# Altium schematic sheet 2020智能车.SchDoc
size A1; Organization: Altium Limited; Address1: L3, 12a Rodborough Rd; Address2: Frenchs Forest; Address3: NSW; Address4: Australia 2086
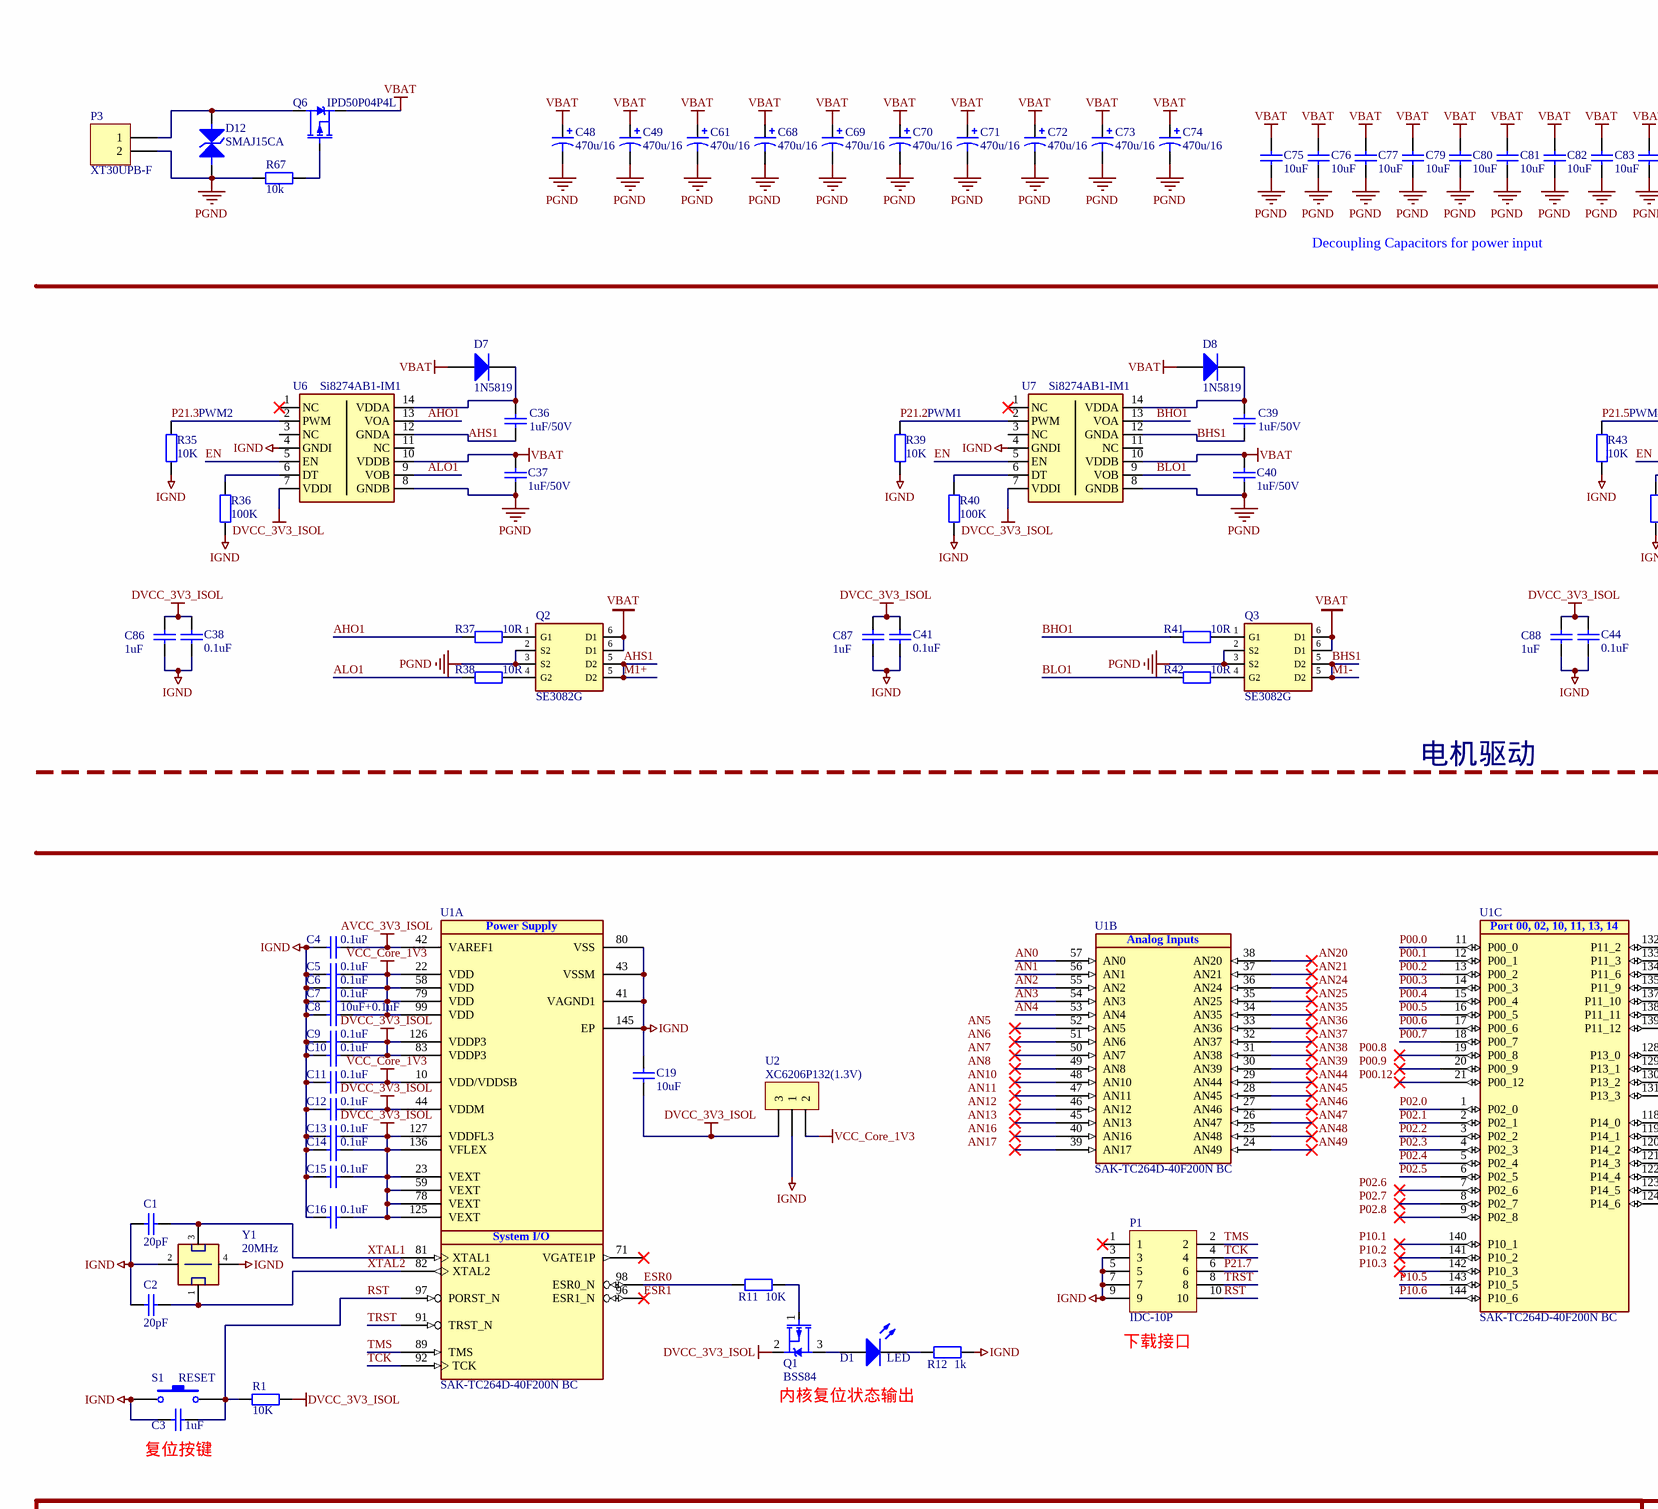
[diagram p0: 2020智能车.SchDoc, top left]
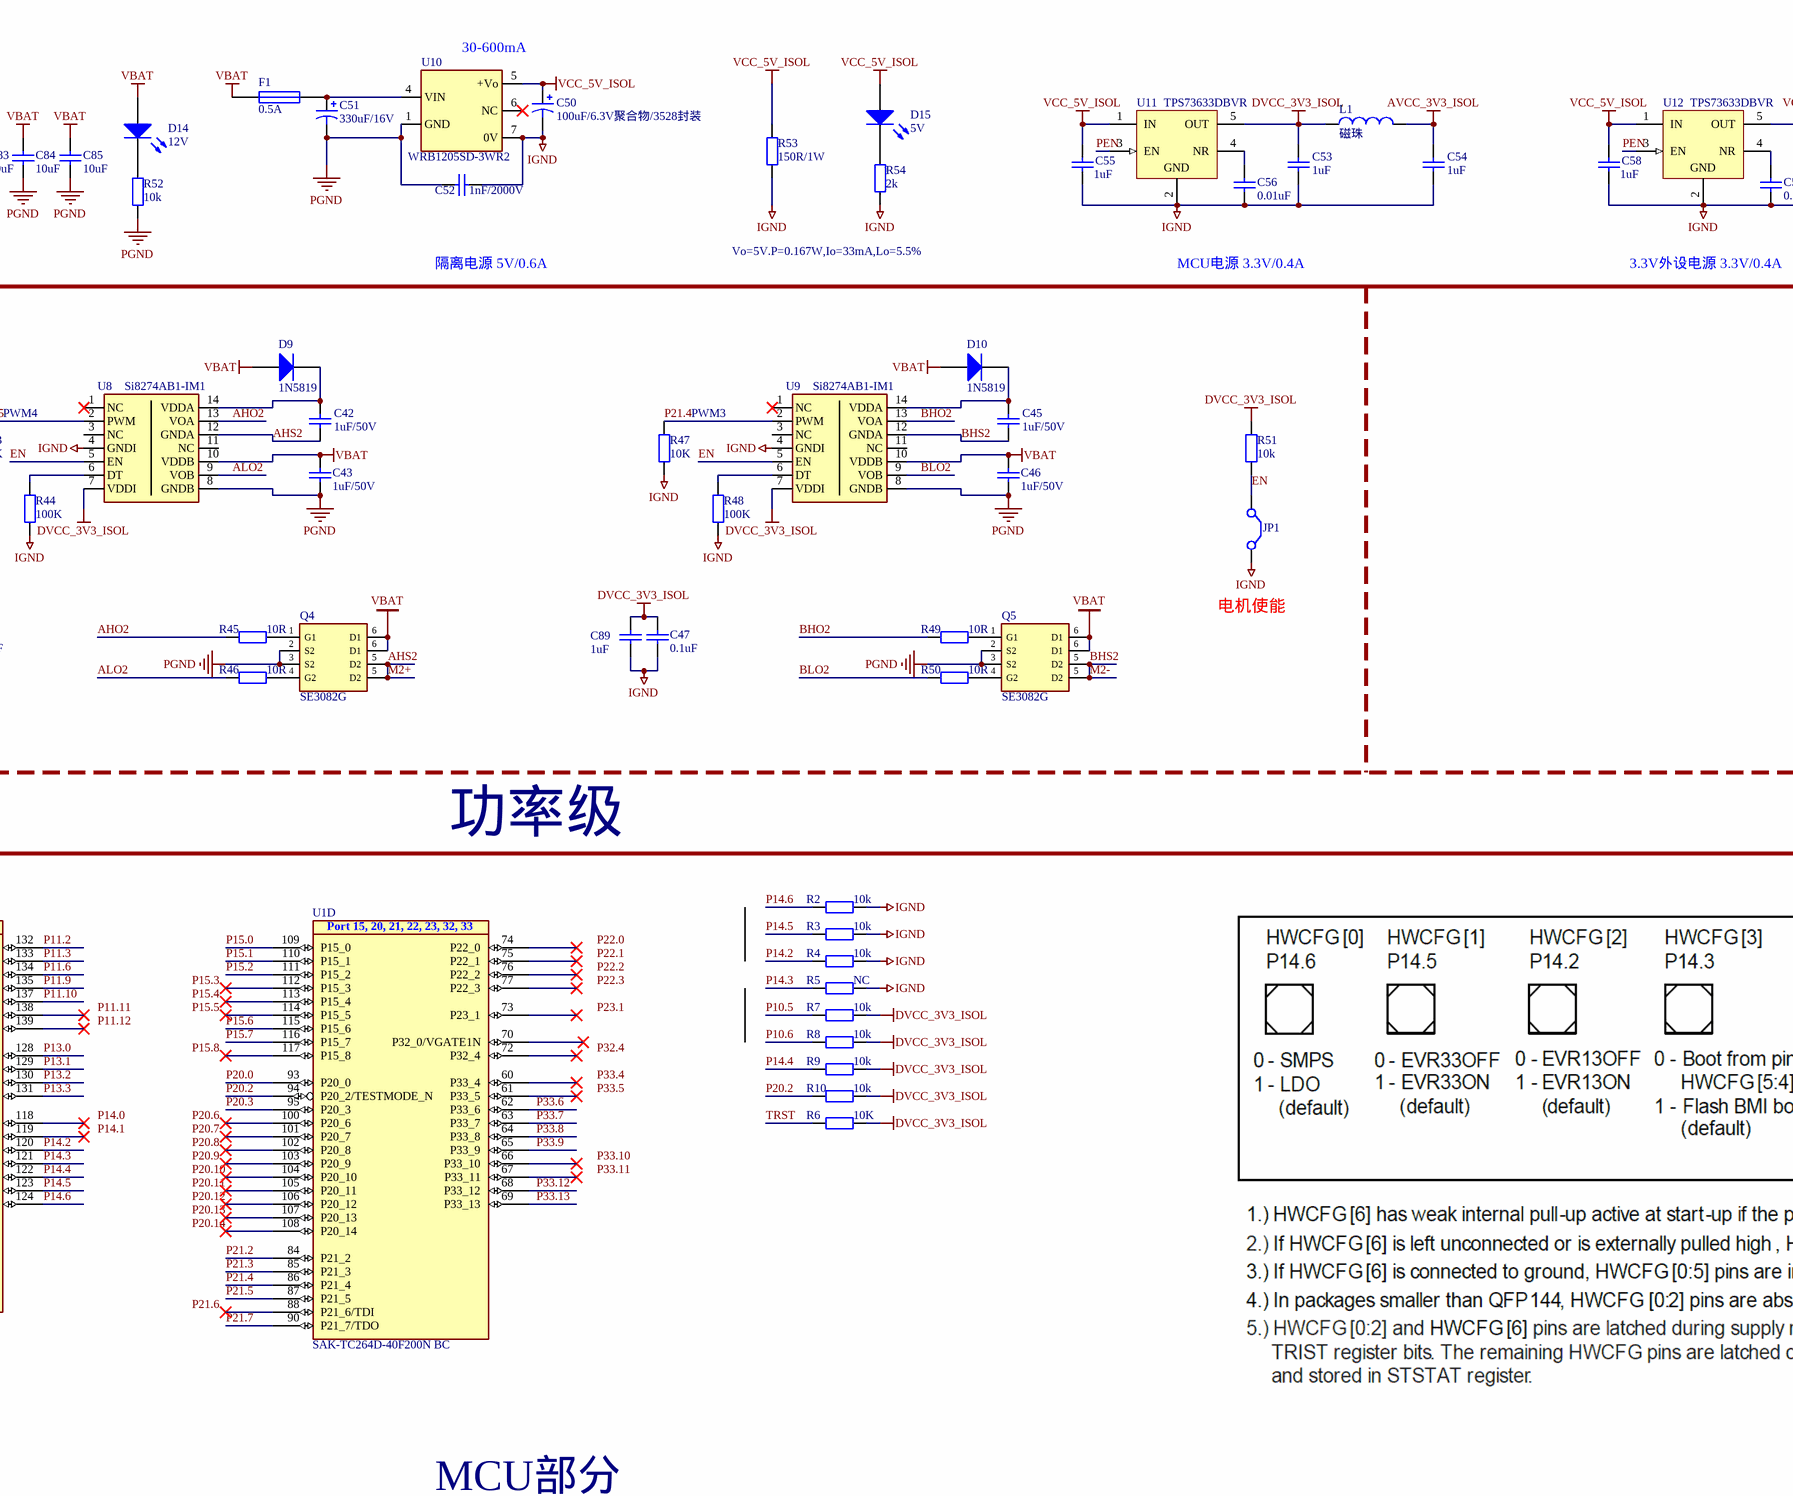
[diagram p1: 2020智能车.SchDoc, top middle]
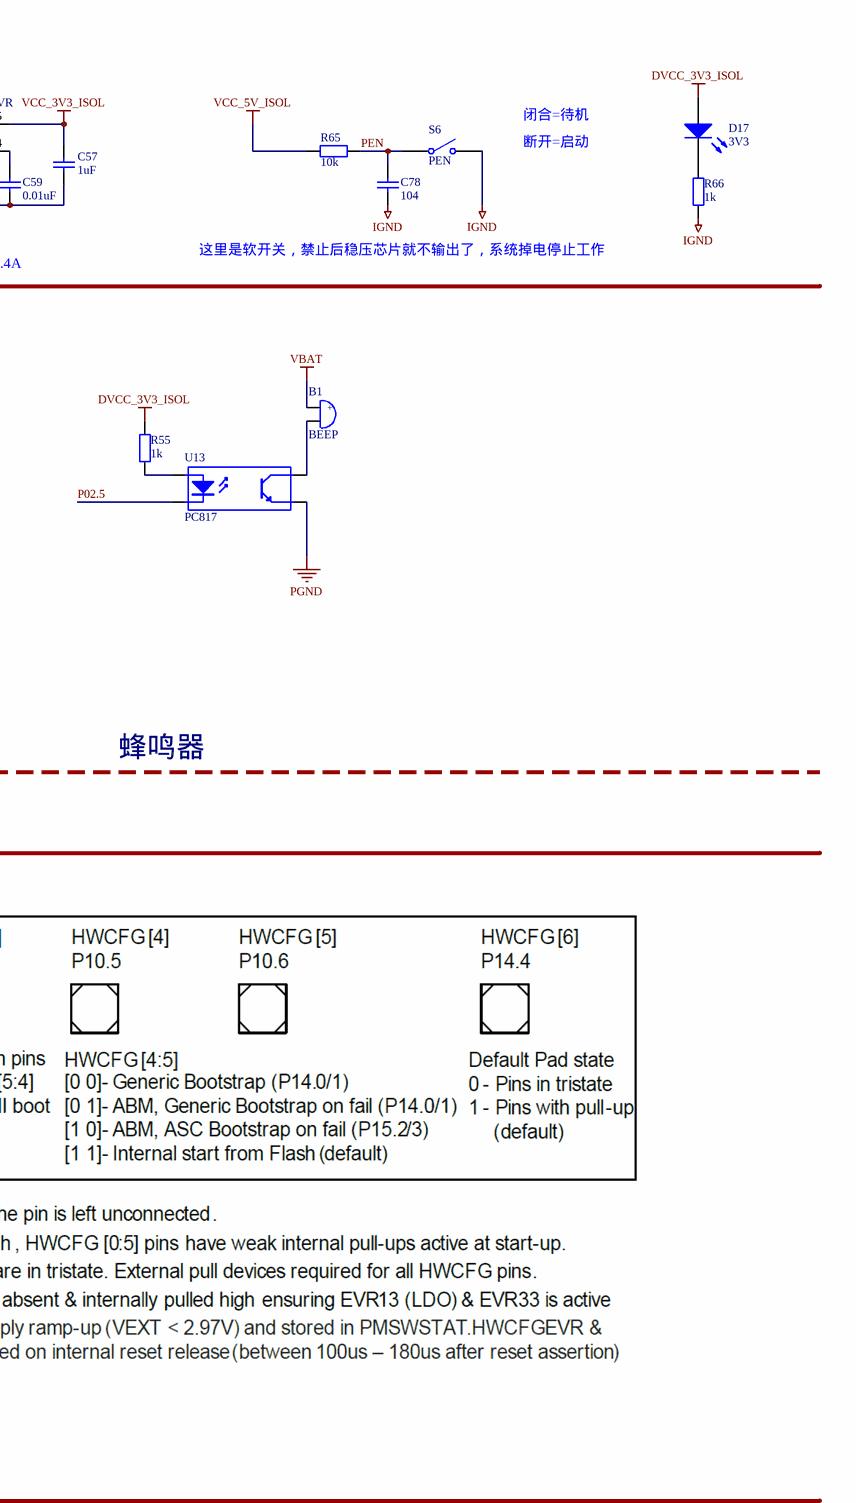
[diagram p2: 2020智能车.SchDoc, top right]
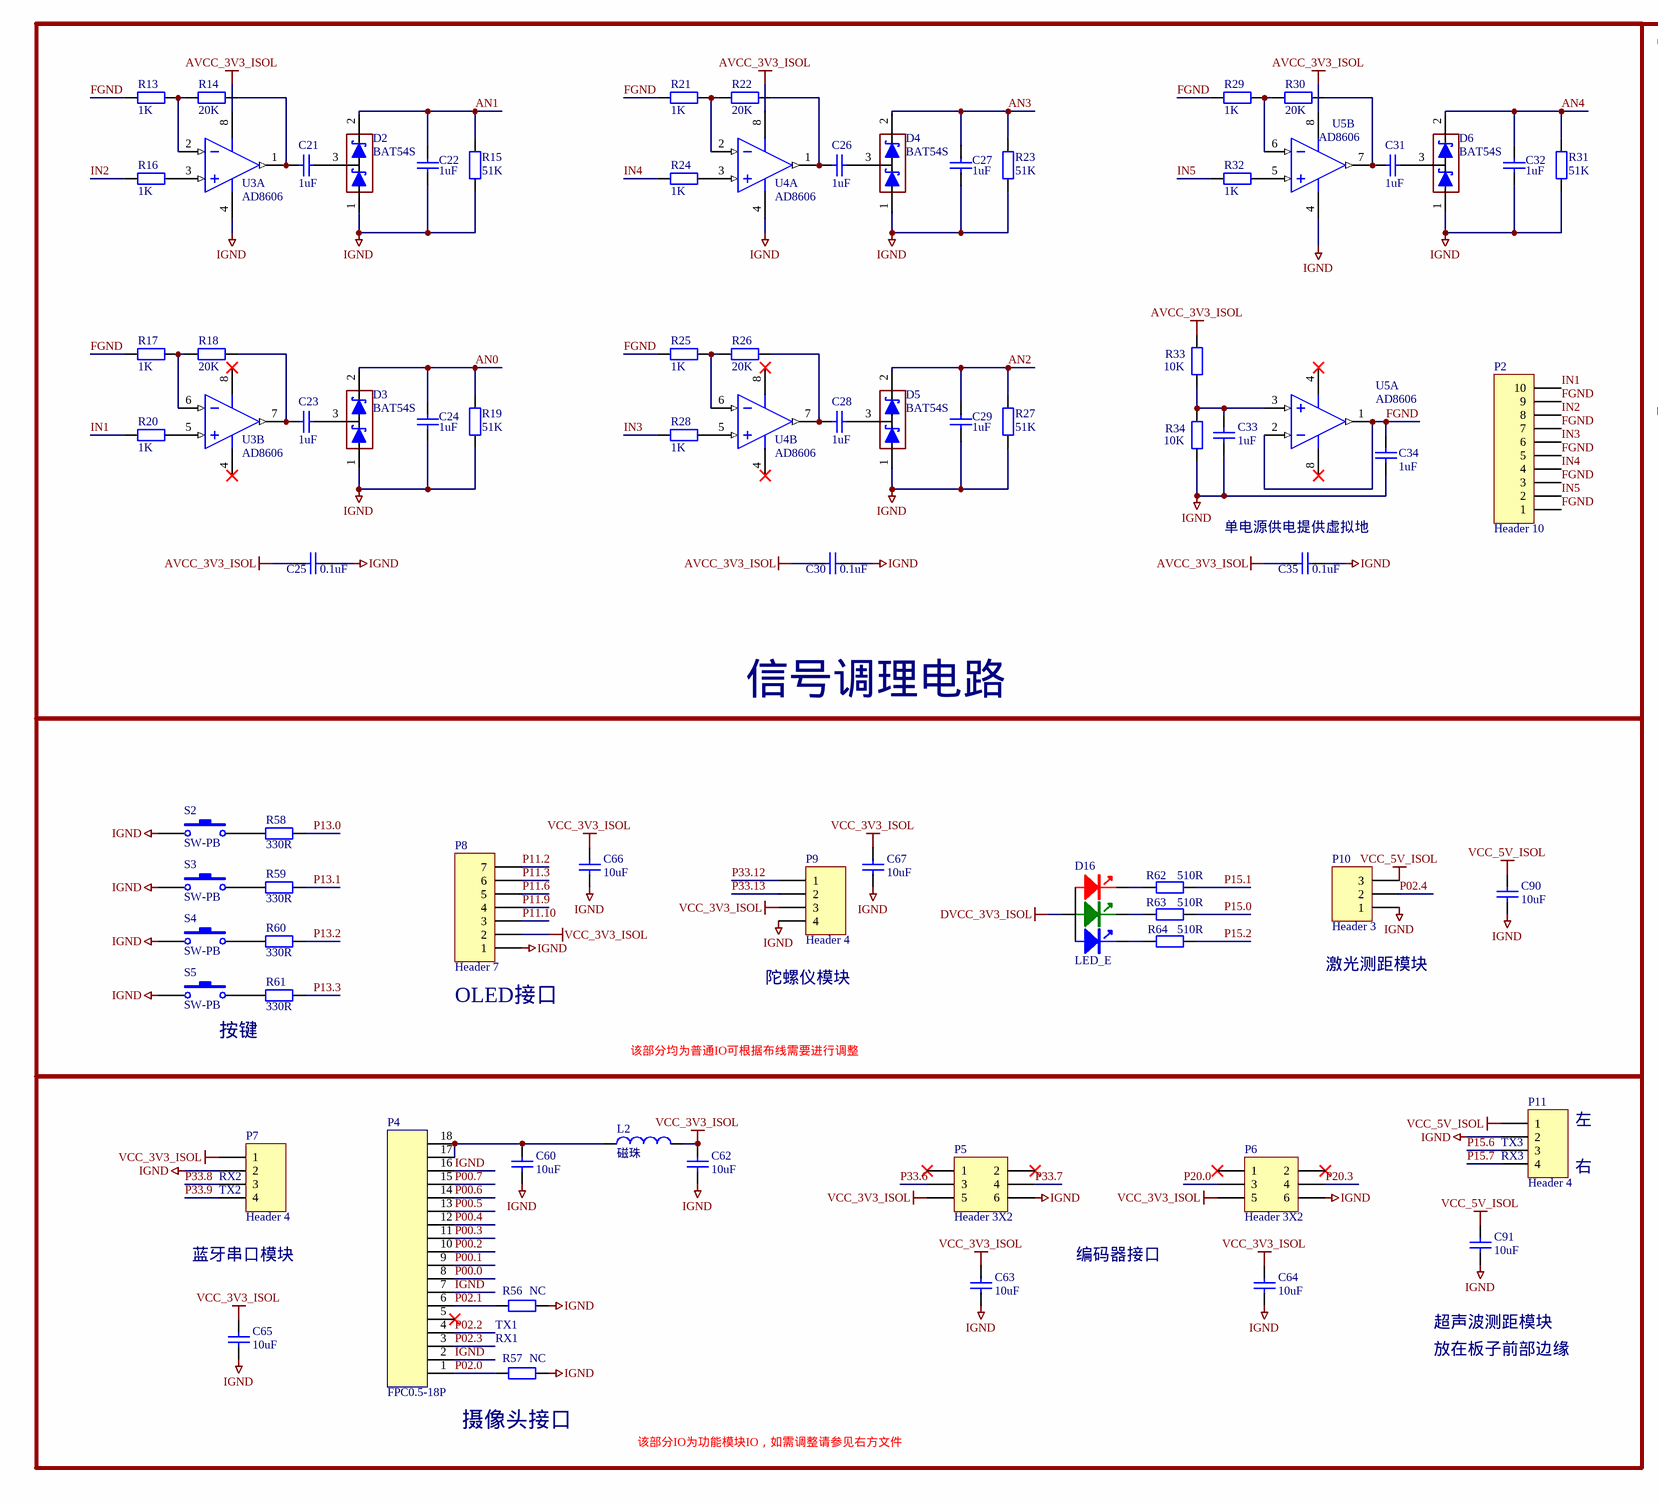
[diagram p3: 2020智能车.SchDoc, bottom left]
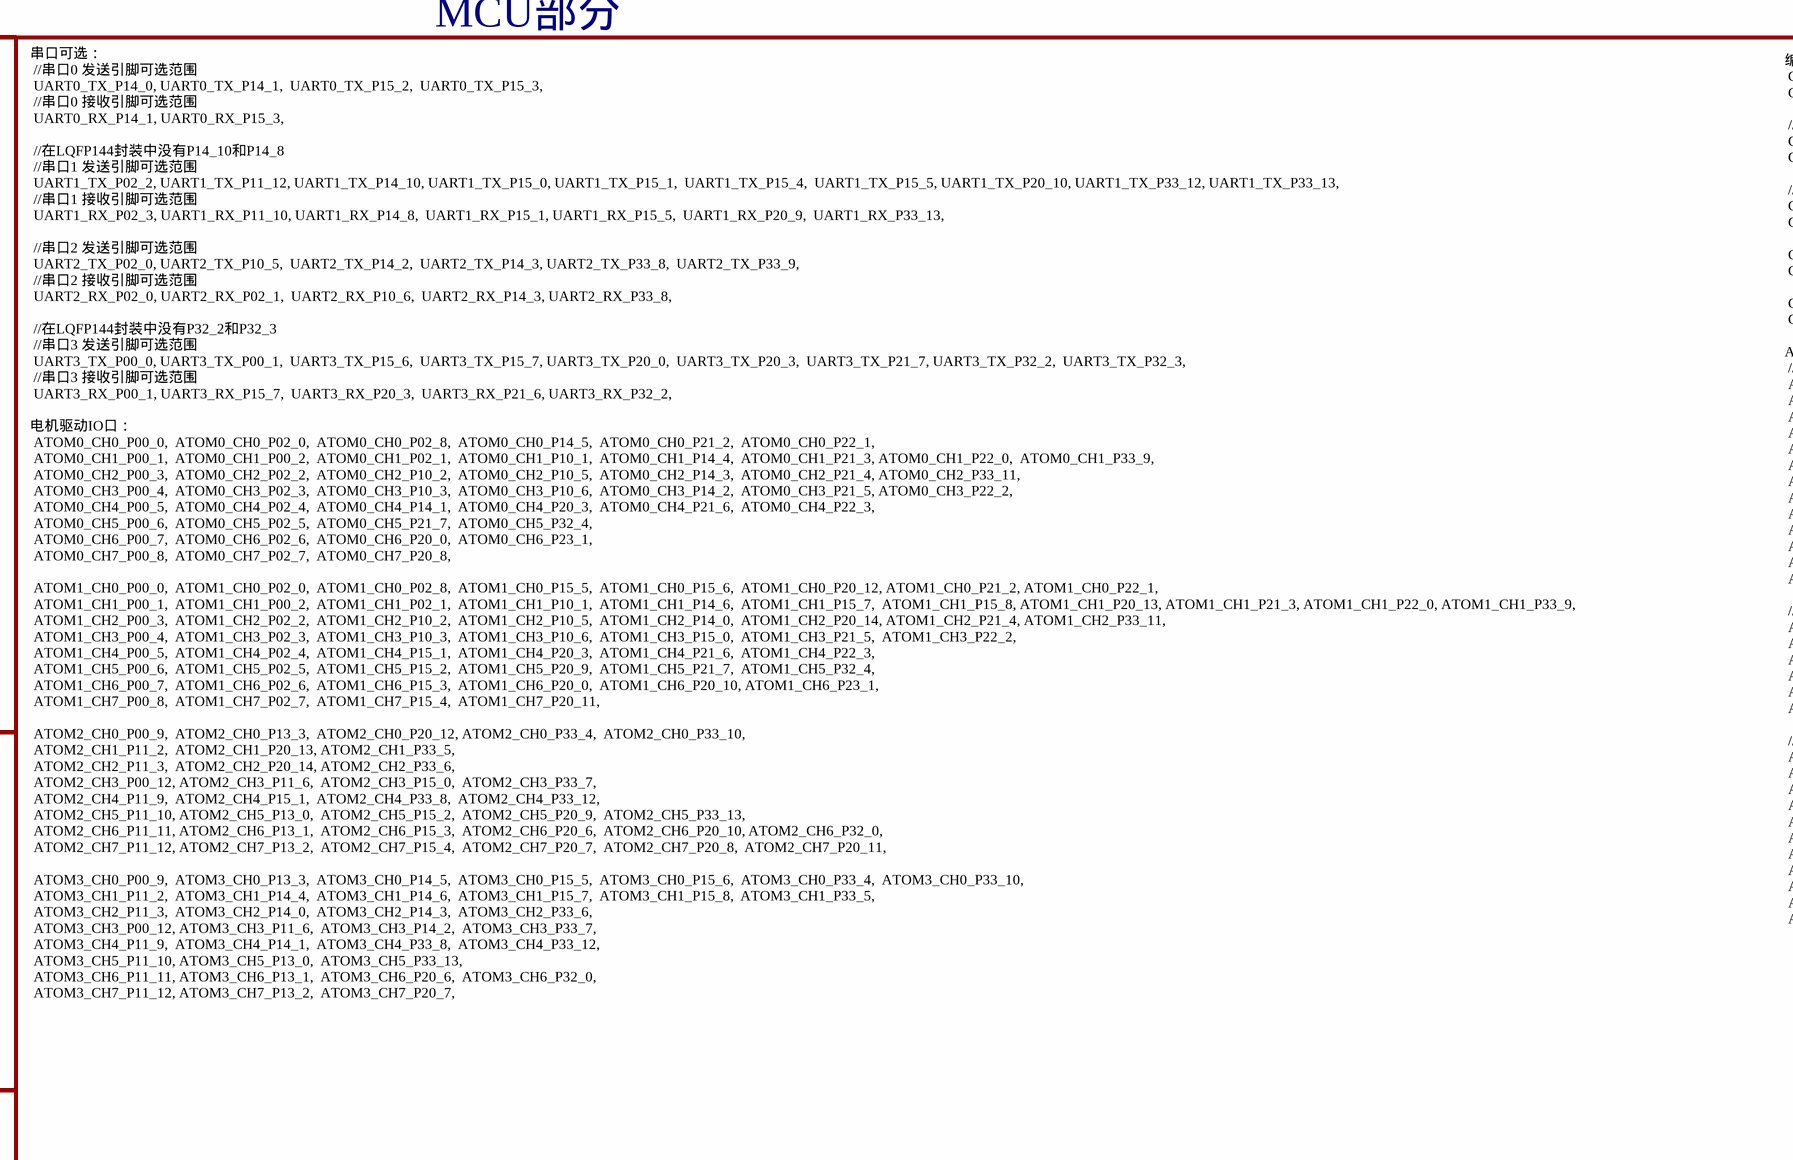
[diagram p4: 2020智能车.SchDoc, bottom middle]
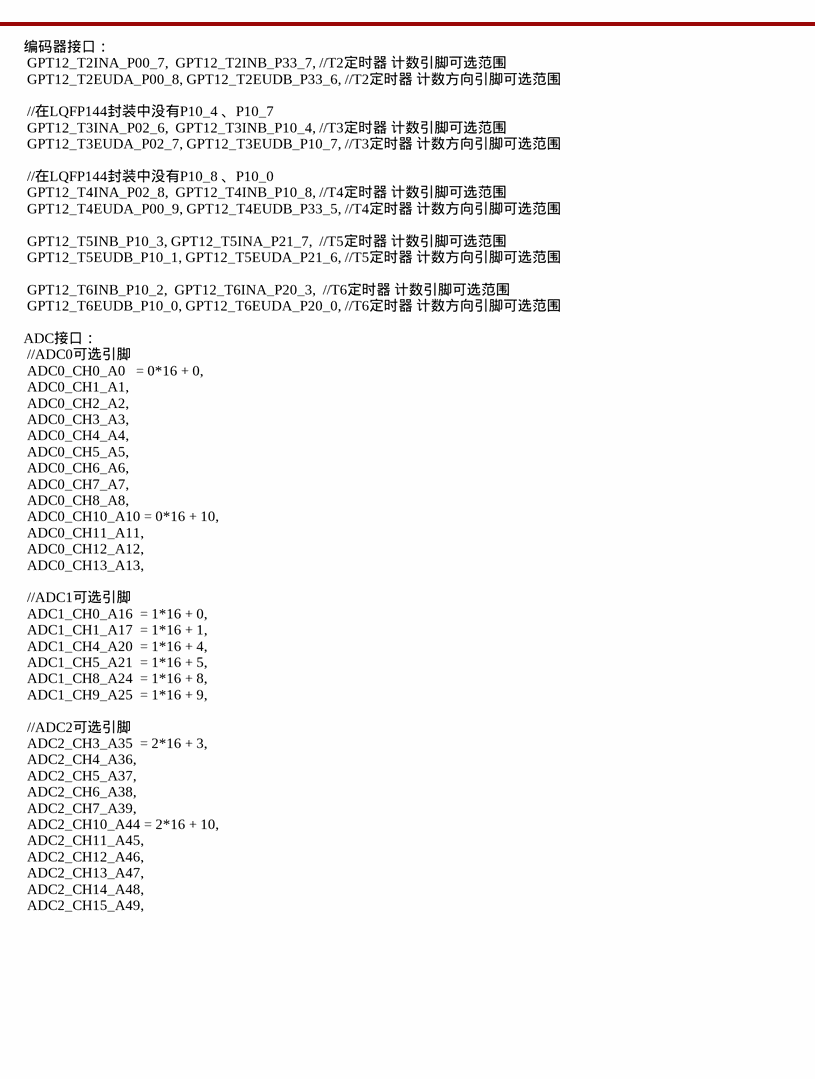
[diagram p5: 2020智能车.SchDoc, bottom right]

## Parts
B1  BEEP  [E10/5]
C1  value 20pF  [0603-1]  (hidden comment: Cap)
C2  value 20pF  [0603-1]  (hidden comment: Cap)
C3  1uF  [0603-1]
C4  0.1uF  [0603-1]
C5  0.1uF  [0603-1]
C6  0.1uF  [0603-1]
C7  0.1uF  [0603-1]
C8  10uF+0.1uF  [0603-1]
C9  0.1uF  [0603-1]
C10  0.1uF  [0603-1]
C11  0.1uF  [0603-1]
C12  0.1uF  [0603-1]
C13  0.1uF  [0603-1]
C14  0.1uF  [0603-1]
C15  0.1uF  [0603-1]
C16  0.1uF  [0603-1]
C19  10uF  [0603-1]
C21  1uF  [0603-1]
C22  1uF  [0603-1]
C23  1uF  [0603-1]
C24  1uF  [0603-1]
C25  0.1uF  [0603-1]
C26  1uF  [0603-1]
C27  1uF  [0603-1]
C28  1uF  [0603-1]
C29  1uF  [0603-1]
C30  0.1uF  [0603-1]
C31  1uF  [0603-1]
C32  1uF  [0603-1]
C33  1uF  [0603-1]
C34  1uF  [0603-1]
C35  0.1uF  [0603-1]
C36  1uF/50V  [0603-1]
C37  1uF/50V  [0603-1]
C38  0.1uF  [0603-1]
C39  1uF/50V  [0603-1]
C40  1uF/50V  [0603-1]
C41  0.1uF  [0603-1]
C42  1uF/50V  [0603-1]
C43  1uF/50V  [0603-1]
C44  0.1uF  [0603-1]
C45  1uF/50V  [0603-1]
C46  1uF/50V  [0603-1]
C47  0.1uF  [0603-1]
C48  470u/16  [E10/5]
C49  470u/16  [E10/5]
C50  100uF/6.3V聚合物/3528封装  [3528-B]
C51  330uF/16V  [E6.5/2.5]
C52  1nF/2000V  [1812]
C53  1uF  [0603-1]
C54  1uF  [0603-1]
C55  1uF  [0603-1]
C56  0.01uF  [0603-1]
C57  1uF  [0603-1]
C58  1uF  [0603-1]
C59  0.01uF  [0603-1]
C60  10uF  [0603-1]
C61  470u/16  [E10/5]
C62  10uF  [0603-1]
C63  10uF  [0805-3]
C64  10uF  [0805-3]
C65  10uF  [0603-1]
C66  10uF  [0603-1]
C67  10uF  [0603-1]
C68  470u/16  [E10/5]
C69  470u/16  [E10/5]
C70  470u/16  [E10/5]
C71  470u/16  [E10/5]
C72  470u/16  [E10/5]
C73  470u/16  [E10/5]
C74  470u/16  [E10/5]
C75  10uF  [3528-B]
C76  10uF  [3528-B]
C77  10uF  [3528-B]
C78  104  [0603-1]
C79  10uF  [3528-B]
C80  10uF  [3528-B]
C81  10uF  [3528-B]
C82  10uF  [3528-B]
C83  10uF  [3528-B]
C84  10uF  [3528-B]
C85  10uF  [3528-B]
C86  1uF  [0603-1]
C87  1uF  [0603-1]
C88  1uF  [0603-1]
C89  1uF  [0603-1]
C90  10uF  [0603-1]
C91  10uF  [0603-1]
D1  LED  [0603-3]
D2  BAT54S  [SOT-23-3]
D3  BAT54S  [SOT-23-3]
D4  BAT54S  [SOT-23-3]
D5  BAT54S  [SOT-23-3]
D6  BAT54S  [SOT-23-3]
D7  1N5819  [3216-A]
D8  1N5819  [3216-A]
D9  1N5819  [3216-A]
D10  1N5819  [3216-A]
D12  SMAJ15CA  [6032-C]
D14  12V  [0603-3]
D15  5V  [0603-3]
D16  LED_E  [1210-DLED]
D17  3V3  [0603-3]
F1  0.5A  [1812]
JP1  Jumper  [CON-2S]  (value not drawn)
L1  磁珠  [0805-3]
L2  磁珠  [0805-3]
P1  IDC-10P  [MHDR2X5]
P2  Header 10  [MX 1.25-WS-10P]
P3  XT30UPB-F  [XT30UPB-F]
P4  FPC0.5-18P  [FPC18-0.5]
P5  Header 3X2  [con-6D]
P6  Header 3X2  [con-6D]
P7  Header 4  [con-4s]
P8  Header 7  [con-7s]
P9  Header 4  [con-4S]
P10  Header 3  [CON-3S]
P11  Header 4  [CON-4S]
Q1  BSS84  [SOT-23-3]
Q2  SE3082G  [DFN-8_L5.5-W5.2-P1.27-LS6.0-BL-EP2]
Q3  SE3082G  [DFN-8_L5.5-W5.2-P1.27-LS6.0-BL-EP2]
Q4  SE3082G  [DFN-8_L5.5-W5.2-P1.27-LS6.0-BL-EP2]
Q5  SE3082G  [DFN-8_L5.5-W5.2-P1.27-LS6.0-BL-EP2]
Q6  IPD50P04P4L  [TO-252]
R1  10K  [0603-1]
R2  10k  [0603-1]
R3  10k  [0603-1]
R4  10k  [0603-1]
R5  NC  [0603-1]
R6  10K  [0603-1]
R7  10k  [0603-1]
R8  10k  [0603-1]
R9  10k  [0603-1]
R10  10k  [0603-1]
R11  10K  [0603-1]
R12  1k  [0603-1]
R13  1K  [0603-1]
R14  20K  [0603-1]
R15  51K  [0603-1]
R16  1K  [0603-1]
R17  1K  [0603-1]
R18  20K  [0603-1]
R19  51K  [0603-1]
R20  1K  [0603-1]
R21  1K  [0603-1]
R22  20K  [0603-1]
R23  51K  [0603-1]
R24  1K  [0603-1]
R25  1K  [0603-1]
R26  20K  [0603-1]
R27  51K  [0603-1]
R28  1K  [0603-1]
R29  1K  [0603-1]
R30  20K  [0603-1]
R31  51K  [0603-1]
R32  1K  [0603-1]
R33  10K  [0603-1]
R34  10K  [0603-1]
R35  10K  [0603-1]
R36  100K  [0603-1]
R37  10R  [0603-1]
R38  10R  [0603-1]
R39  10K  [0603-1]
R40  100K  [0603-1]
R41  10R  [0603-1]
R42  10R  [0603-1]
R43  10K  [0603-1]
R44  100K  [0603-1]
R45  10R  [0603-1]
R46  10R  [0603-1]
R47  10K  [0603-1]
R48  100K  [0603-1]
R49  10R  [0603-1]
R50  10R  [0603-1]
R51  10k  [0603-1]
R52  10k  [0603-1]
R53  150R/1W  [1812]
R54  2k  [0603-1]
R55  1k  [0603-1]
R56  NC  [0603-1]
R57  NC  [0603-1]
R58  330R  [0603-1]
R59  330R  [0603-1]
R60  330R  [0603-1]
R61  330R  [0603-1]
R62  510R  [0603-1]
R63  510R  [0603-1]
R64  510R  [0603-1]
R65  10k  [0603-1]
R66  1k  [0603-1]
R67  10k  [0603-1]
S1  RESET  [TD-3580]
S2  SW-PB  [TD-3580]
S3  SW-PB  [TD-3580]
S4  SW-PB  [TD-3580]
S5  SW-PB  [TD-3580]
S6  PEN  [SSD1210]
U1  SAK-TC264D-40F200N BC  [QFP50P2200X2200X160-145N-1]  (parts A,B,C,D of 4)
U2  XC6206P132(1.3V)  [SOT-23-3]
U3  AD8606  [SO-8]  (parts A,B of 2)
U4  AD8606  [SO-8]  (parts A,B of 2)
U5  AD8606  [SO-8]  (parts A,B of 2)
U6  Si8274AB1-IM1  [LGA-14_L5.0-W5.0-P0.65-BL]
U7  Si8274AB1-IM1  [LGA-14_L5.0-W5.0-P0.65-BL]
U8  Si8274AB1-IM1  [LGA-14_L5.0-W5.0-P0.65-BL]
U9  Si8274AB1-IM1  [LGA-14_L5.0-W5.0-P0.65-BL]
U10  WRB1205SD-3WR2  [WRB_SD-3WR2]
U11  TPS73633DBVR  [SOT-23-5]
U12  TPS73633DBVR  [SOT-23-5]
U13  PC817  [DIP-4]
Y1  20MHz  [CFPX-5]

## Blocks framed on the sheet
单电源供电提供虚拟地: C21-C35 D2-D6 P2 R13-R34 U3-U5
信号调理电路: C66 C67 C90 D16 P8-P10 R58-R64 S2-S5
摄像头接口: C60 C62-C65 C91 L2 P4-P7 P11 R56 R57

## Nets
AVCC_3V3_ISOL: C4.1 C25.1 C30.1 C35.1 C54.1 L1.2 R33.1 U1.42(VAREF1) U3.8(+V) U4.8(+V) U5.8(+V)
DVCC_3V3_ISOL: C9.1 C10.1 C12.1 C13.1 C14.1 C15.1 C16.1 C19.2 C38.2 C41.2 C44.2 C47.2 C53.1 C86.2 C87.2 C88.2 C89.2 D16.2 D17.1(A) L1.1 Q1.2(S) R1.1 R6.1 R7.1 R8.1 R9.1 R10.1 R51.2 R55.1 U1.23(VEXT) U1.44(VDDM) U1.59(VEXT) U1.78(VEXT) U1.83(VDDP3) U1.125(VEXT) U1.126(VDDP3) U1.127(VDDFL3) U1.136(VFLEX) U2.3 U6.7(VDDI) U7.7(VDDI) U8.7(VDDI) U9.7(VDDI) U11.5(OUT)
IGND: C1.1 C2.1 C3.1 C4.2 C5.2 C6.2 C7.2 C8.2 C9.2 C10.2 C11.2 C12.2 C13.2 C14.2 C15.2 C16.2 C19.1 C22.1 C24.1 C25.2 C27.1 C29.1 C30.2 C32.1 C33.2 C34.1 C35.2 C38.1 C41.1 C44.1 C47.1 C50.2 C52.1 C53.2 C54.2 C55.2 C56.1 C57.2 C58.2 C59.1 C60.2 C62.2 C63.2 C64.2 C65.2 C66.2 C67.2 C78.2 C86.1 C87.1 C88.1 C89.1 C90.2 C91.2 D2.1 D3.1 D4.1 D5.1 D6.1 JP1.2(C2) P1.3 P1.5 P1.7 P1.9 P4.2 P4.7 P4.16 P5.6 P6.6 P7.2 P8.1 P9.4 P10.1 P11.2 R2.1 R3.1 R4.1 R5.1 R12.1 R15.2 R19.2 R23.2 R27.2 R31.2 R34.2 R35.1 R36.1 R39.1 R40.1 R43.1 R44.1 R47.1 R48.1 R53.1 R54.1 R56.1 R57.1 R66.1 S1.1 S2.1 S3.1 S4.1 S5.1 S6.2(NO) U1.41(VAGND1) U1.43(VSSM) U1.80(VSS) U1.145(EP) U2.1 U3.4(-V) U4.4(-V) U5.4(-V) U6.4(GNDI) U7.4(GNDI) U8.4(GNDI) U9.4(GNDI) U10.7(0V) U11.2(GND) U12.2(GND) Y1.2 Y1.4
PGND: C37.2 C40.2 C43.2 C46.2 C48.2 C49.2 C51.2 C52.2 C61.2 C68.2 C69.2 C70.2 C71.2 C72.2 C73.2 C74.2 C75.2 C76.2 C77.2 C79.2 C80.2 C81.2 C82.2 C83.2 C84.2 C85.2 D12.K P3.2 Q2.2(S2) Q2.3(S2) Q3.2(S2) Q3.3(S2) Q4.2(S2) Q4.3(S2) Q5.2(S2) Q5.3(S2) R52.1 R67.2 U6.8(GNDB) U7.8(GNDB) U8.8(GNDB) U9.8(GNDB) U10.1(GND) U13.3(E)
VBAT: B1.1 C37.1 C40.1 C43.1 C46.1 C48.1 C49.1 C61.1 C68.1 C69.1 C70.1 C71.1 C72.1 C73.1 C74.1 C75.1 C76.1 C77.1 C79.1 C80.1 C81.1 C82.1 C83.1 C84.1 C85.1 D7.1(A) D8.1(A) D9.1(A) D10.1(A) D14.1(A) F1.1 Q2.6(D1) Q3.6(D1) Q4.6(D1) Q5.6(D1) Q6.S U6.10(VDDB) U7.10(VDDB) U8.10(VDDB) U9.10(VDDB)
VCC_3V3_ISOL: C57.1 C62.1 C63.1 C64.1 C65.1 C66.1 C67.1 L2.2 P5.5 P6.5 P7.1 P8.2 P9.3 U12.5(OUT)
VCC_5V_ISOL: C50.1 C55.1 C58.1 C90.1 C91.1 D15.1(A) P10.3 P11.1 R53.2 R65.1 U10.5(+Vo) U11.1(IN) U12.1(IN)
VCC_Core_1V3: C5.1 C6.1 C7.1 C8.1 C11.1 U1.10(VDD/VDDSB) U1.22(VDD) U1.58(VDD) U1.79(VDD) U1.99(VDD) U2.2
AHO1: R37.1 U6.13(VOA)
AHO2: R45.1 U8.13(VOA)
AHS1: C36.2 Q2.5(D2) U6.12(GNDA)  [also labelled M1+]
AHS2: C42.2 Q4.5(D2) U8.12(GNDA)  [also labelled M2+]
ALO1: R38.1 U6.9(VOB)
ALO2: R46.1 U8.9(VOB)
AN0: C24.2 D3.2 R19.1 U1.57(AN0)
AN1: C22.2 D2.2 R15.1 U1.56(AN1)
AN2: C29.2 D5.2 R27.1 U1.55(AN2)
AN3: C27.2 D4.2 R23.1 U1.54(AN3)
AN4: C32.2 D6.2 R31.1 U1.53(AN4)
BHO1: R41.1 U7.13(VOA)
BHO2: R49.1 U9.13(VOA)
BHS1: C39.2 Q3.5(D2) U7.12(GNDA)  [also labelled M1-]
BHS2: C45.2 Q5.5(D2) U9.12(GNDA)  [also labelled M2-]
BLO1: R42.1 U7.9(VOB)
BLO2: R50.1 U9.9(VOB)
EN: JP1.1(C1) R51.1 U6.5(EN) U7.5(EN) U8.5(EN) U9.5(EN)
ESR0: R11.2 U1.98(ESR0_N)
ESR1: U1.96(ESR1_N)
FGND: C34.2 P2.1 P2.3 P2.5 P2.7 P2.9 R13.1 R17.1 R21.1 R25.1 R29.1 U5.1(OUT_A) U5.2(-IN_A)
IN1: P2.10 R20.1
IN2: P2.8 R16.1
IN3: P2.6 R28.1
IN4: P2.4 R24.1
IN5: P2.2 R32.1
P00.0: P4.8 U1.11(P00_0)
P00.1: P4.9 U1.12(P00_1)
P00.2: P4.10 U1.13(P00_2)
P00.3: P4.11 U1.14(P00_3)
P00.4: P4.12 U1.15(P00_4)
P00.5: P4.13 U1.16(P00_5)
P00.6: P4.14 U1.17(P00_6)
P00.7: P4.15 U1.18(P00_7)
P02.0: P4.1 R57.2 U1.1(P02_0)
P02.1: P4.6 R56.2 U1.2(P02_1)
P02.2: P4.4 U1.3(P02_2)
P02.3: P4.3 U1.4(P02_3)
P02.4: P10.2 U1.5(P02_4)
P02.5: U1.6(P02_5) U13.2(K)
P10.5: R7.2 U1.143(P10_5)
P10.6: R8.2 U1.144(P10_6)
P11.2: P8.7 U1.132(P11_2)
P11.3: P8.6 U1.133(P11_3)
P11.6: P8.5 U1.134(P11_6)
P11.9: P8.4 U1.135(P11_9)
P11.10: P8.3 U1.137(P11_10)
P13.0: R58.2 U1.128(P13_0)
P13.1: R59.2 U1.129(P13_1)
P13.2: R60.2 U1.130(P13_2)
P13.3: R61.2 U1.131(P13_3)
P14.2: R4.2 U1.120(P14_2)
P14.3: R5.2 U1.121(P14_3)
P14.4: R9.2 U1.122(P14_4)
P14.5: R3.2 U1.123(P14_5)
P14.6: R2.2 U1.124(P14_6)
P15.0: R63.1 U1.109(P15_0)
P15.1: R62.1 U1.110(P15_1)
P15.2: R64.1 U1.111(P15_2)
P15.6: P11.3 U1.115(P15_6)
P15.7: P11.4 U1.116(P15_7)
P20.0: P6.3 U1.93(P20_0)
P20.2: R10.2 U1.94(P20_2/TESTMODE_N)
P20.3: P6.4 U1.95(P20_3)
P21.2: R39.2 U1.84(P21_2) U7.2(PWM)
P21.3: R35.2 U1.85(P21_3) U6.2(PWM)
P21.4: R47.2 U1.86(P21_4) U9.2(PWM)
P21.5: R43.2 U1.87(P21_5) U8.2(PWM)
P21.7: P1.6 U1.90(P21_7/TDO)
P33.6: P5.3 U1.62(P33_6)
P33.7: P5.4 U1.63(P33_7)
P33.8: P7.3 U1.64(P33_8)
P33.9: P7.4 U1.65(P33_9)
P33.12: P9.1 U1.68(P33_12)
P33.13: P9.2 U1.69(P33_13)
PEN: C78.1 R65.2 S6.1(COMMON) U11.3(EN) U12.3(EN)
RST: C3.2 P1.10 R1.2 S1.2 U1.97(PORST_N)
TCK: P1.4 U1.92(TCK)
TMS: P1.2 U1.89(TMS)
TRST: P1.8 R6.2 U1.91(TRST_N)
XTAL1: C1.2 U1.81(XTAL1) Y1.3
XTAL2: C2.2 U1.82(XTAL2) Y1.1
NetB1_2: B1.2 U13.4(C)
NetC21_1: C21.1 D2.3
NetC21_2: C21.2 R14.2 U3.1(OUT_A)
NetC23_1: C23.1 D3.3
NetC23_2: C23.2 R18.2 U3.7(OUT_B)
NetC26_1: C26.1 D4.3
NetC26_2: C26.2 R22.2 U4.1(OUT_A)
NetC28_1: C28.1 D5.3
NetC28_2: C28.2 R26.2 U4.7(OUT_B)
NetC31_1: C31.1 D6.3
NetC31_2: C31.2 R30.2 U5.7(OUT_B)
NetC33_1: C33.1 R33.2 R34.1 U5.3(+IN_A)
NetC36_1: C36.1 D7.2(K) U6.14(VDDA)
NetC39_1: C39.1 D8.2(K) U7.14(VDDA)
NetC42_1: C42.1 D9.2(K) U8.14(VDDA)
NetC45_1: C45.1 D10.2(K) U9.14(VDDA)
NetC51_1: C51.1 F1.2 U10.4(VIN)
NetC56_2: C56.2 U11.4(NR)
NetC59_2: C59.2 U12.4(NR)
NetC60_1: C60.1 L2.1 P4.17 P4.18
NetD1_1: D1.1(A) Q1.3(D)
NetD1_2: D1.2(K) R12.2
NetD12_A: D12.A P3.1 Q6.D
NetD14_2: D14.2(K) R52.2
NetD15_2: D15.2(K) R54.2
NetD16_1: D16.1 R62.2
NetD16_3: D16.3 R63.2
NetD16_4: D16.4 R64.2
NetD17_2: D17.2(K) R66.2
NetQ1_1: Q1.1(G) R11.1
NetQ2_1: Q2.1(G1) R37.2
NetQ2_4: Q2.4(G2) R38.2
NetQ3_1: Q3.1(G1) R41.2
NetQ3_4: Q3.4(G2) R42.2
NetQ4_1: Q4.1(G1) R45.2
NetQ4_4: Q4.4(G2) R46.2
NetQ5_1: Q5.1(G1) R49.2
NetQ5_4: Q5.4(G2) R50.2
NetQ6_G: Q6.G R67.1
NetR13_2: R13.2 R14.1 U3.2(-IN_A)
NetR16_2: R16.2 U3.3(+IN_A)
NetR17_2: R17.2 R18.1 U3.6(-IN_B)
NetR20_2: R20.2 U3.5(+IN_B)
NetR21_2: R21.2 R22.1 U4.2(-IN_A)
NetR24_2: R24.2 U4.3(+IN_A)
NetR25_2: R25.2 R26.1 U4.6(-IN_B)
NetR28_2: R28.2 U4.5(+IN_B)
NetR29_2: R29.2 R30.1 U5.6(-IN_B)
NetR32_2: R32.2 U5.5(+IN_B)
NetR36_2: R36.2 U6.6(DT)
NetR40_2: R40.2 U7.6(DT)
NetR44_2: R44.2 U8.6(DT)
NetR48_2: R48.2 U9.6(DT)
NetR55_2: R55.2 U13.1(A)
NetR58_1: R58.1 S2.2
NetR59_1: R59.1 S3.2
NetR60_1: R60.1 S4.2
NetR61_1: R61.1 S5.2

Not connected (* = marked no-connect by the designer): P1 1*; P4 5*; P5 1* 2*; P6 1* 2*; U1 7(P02_6)* 8(P02_7)* 9(P02_8)* 19(P00_8)* 20(P00_9)* 21(P00_12)* 24(AN49)* 25(AN48)* 26(AN47)* 27(AN46)* 28(AN45)* 29(AN44)* 30(AN39)* 31(AN38)* 32(AN37)* 33(AN36)* 34(AN35)* 35(AN25)* 36(AN24)* 37(AN21)* 38(AN20)* 39(AN17)* 40(AN16)* 45(AN13)* 46(AN12)* 47(AN11)* 48(AN10)* 49(AN8)* 50(AN7)* 51(AN6)* 52(AN5)* 60(P33_4)* 61(P33_5)* 66(P33_10)* 67(P33_11)* 70(P32_0/VGATE1N)* 71(VGATE1P)* 72(P32_4)* 73(P23_1)* 74(P22_0)* 75(P22_1)* 76(P22_2)* 77(P22_3)* 88(P21_6/TDI)* 100(P20_6)* 101(P20_7)* 102(P20_8)* 103(P20_9)* 104(P20_10)* 105(P20_11)* 106(P20_12)* 107(P20_13)* 108(P20_14)* 112(P15_3)* 113(P15_4)* 114(P15_5)* 117(P15_8)* 118(P14_0)* 119(P14_1)* 138(P11_11)* 139(P11_12)* 140(P10_1)* 141(P10_2)* 142(P10_3)*; U6 1(NC)* 3(NC) 11(NC); U7 1(NC)* 3(NC) 11(NC); U8 1(NC)* 3(NC) 11(NC); U9 1(NC)* 3(NC) 11(NC); U10 6(NC)*

## Notes on the sheet
- (near U10) 30-600mA
- 闭合=待机
- 断开=启动
- Decoupling Capacitors for power input
- 隔离电源 5V/0.6A
- Vo=5V.P=0.167W,Io=33mA,Lo=5.5%
- MCU电源 3.3V/0.4A
- 3.3V外设电源 3.3V/0.4A
- (near C78) 这里是软开关，禁止后稳压芯片就不输出了，系统掉电停止工作
- (near R35) PWM2
- (near R39) PWM1
- (near R43) PWM4
- (near R47) PWM3
- (near JP1) 电机使能
- 电机驱动
- 蜂鸣器
- 功率级
- (near P1) 下载接口
- (near C3) 复位按键
- 内核复位状态输出
- MCU部分
- (near P9) 陀螺仪模块
- (near P10) 激光测距模块
- 编码器接口：
  GPT12_T2INA_P00_7,  GPT12_T2INB_P33_7,	//T2定时器 计数引脚可选范围
  GPT12_T2EUDA_P00_8, GPT12_T2EUDB_P33_6,	//T2定时器 计数方向引脚可选范围
  //在LQFP144封装中没有P10_4 、P10_7
  GPT12_T3INA_P02_6,  GPT12_T3INB_P10_4,	//T3定时器 计数引脚可选范围
  GPT12_T3EUDA_P02_7, GPT12_T3EUDB_P10_7, //T3定时器 计数方向引脚可选范围
  //在LQFP144封装中没有P10_8 、P10_0
  GPT12_T4INA_P02_8,  GPT12_T4INB_P10_8,	//T4定时器 计数引脚可选范围
  GPT12_T4EUDA_P00_9, GPT12_T4EUDB_P33_5, //T4定时器 计数方向引脚可选范围
  GPT12_T5INB_P10_3,	GPT12_T5INA_P21_7,  //T5定时器 计数引脚可选范围
  GPT12_T5EUDB_P10_1, GPT12_T5EUDA_P21_6, //T5定时器 计数方向引脚可选范围
  GPT12_T6INB_P10_2,  GPT12_T6INA_P20_3,  //T6定时器 计数引脚可选范围
  GPT12_T6EUDB_P10_0, GPT12_T6EUDA_P20_0, //T6定时器 计数方向引脚可选范围
  ADC接口：
  //ADC0可选引脚
  ADC0_CH0_A0   = 0*16 + 0,
  ADC0_CH1_A1,
  ADC0_CH2_A2,
  ADC0_CH3_A3,
  ADC0_CH4_A4,
  ADC0_CH5_A5,
  ADC0_CH6_A6,
  ADC0_CH7_A7,
  ADC0_CH8_A8,
  ADC0_CH10_A10 = 0*16 + 10,
  ADC0_CH11_A11,
  ADC0_CH12_A12,
  ADC0_CH13_A13,
  //ADC1可选引脚
  ADC1_CH0_A16  = 1*16 + 0,
  ADC1_CH1_A17  = 1*16 + 1,
  ADC1_CH4_A20  = 1*16 + 4,
  ADC1_CH5_A21  = 1*16 + 5,
  ADC1_CH8_A24  = 1*16 + 8,
  ADC1_CH9_A25  = 1*16 + 9,
  //ADC2可选引脚
  ADC2_CH3_A35  = 2*16 + 3,
  ADC2_CH4_A36,
  ADC2_CH5_A37,
  ADC2_CH6_A38,
  ADC2_CH7_A39,
  ADC2_CH10_A44 = 2*16 + 10,
  ADC2_CH11_A45,
  ADC2_CH12_A46,
  ADC2_CH13_A47,
  ADC2_CH14_A48,
  ADC2_CH15_A49,
- 按键
- (near P8) OLED接口
- 串口可选：
  //串口0 发送引脚可选范围
  UART0_TX_P14_0, UART0_TX_P14_1,  UART0_TX_P15_2,  UART0_TX_P15_3,
  //串口0 接收引脚可选范围
  UART0_RX_P14_1, UART0_RX_P15_3,
  //在LQFP144封装中没有P14_10和P14_8
  //串口1 发送引脚可选范围
  UART1_TX_P02_2, UART1_TX_P11_12, UART1_TX_P14_10, UART1_TX_P15_0, UART1_TX_P15_1,  UART1_TX_P15_4,  UART1_TX_P15_5, UART1_TX_P20_10, UART1_TX_P33_12, UART1_TX_P33_13,
  //串口1 接收引脚可选范围
  UART1_RX_P02_3, UART1_RX_P11_10, UART1_RX_P14_8,  UART1_RX_P15_1, UART1_RX_P15_5,  UART1_RX_P20_9,  UART1_RX_P33_13,
  //串口2 发送引脚可选范围
  UART2_TX_P02_0, UART2_TX_P10_5,  UART2_TX_P14_2,  UART2_TX_P14_3, UART2_TX_P33_8,  UART2_TX_P33_9,
  //串口2 接收引脚可选范围
  UART2_RX_P02_0, UART2_RX_P02_1,  UART2_RX_P10_6,  UART2_RX_P14_3, UART2_RX_P33_8,
  //在LQFP144封装中没有P32_2和P32_3
  //串口3 发送引脚可选范围
  UART3_TX_P00_0, UART3_TX_P00_1,  UART3_TX_P15_6,  UART3_TX_P15_7, UART3_TX_P20_0,  UART3_TX_P20_3,  UART3_TX_P21_7, UART3_TX_P32_2,  UART3_TX_P32_3,
  //串口3 接收引脚可选范围
  UART3_RX_P00_1, UART3_RX_P15_7,  UART3_RX_P20_3,  UART3_RX_P21_6, UART3_RX_P32_2,
  电机驱动IO口：
  ATOM0_CH0_P00_0,  ATOM0_CH0_P02_0,  ATOM0_CH0_P02_8,  ATOM0_CH0_P14_5,  ATOM0_CH0_P21_2,  ATOM0_CH0_P22_1,
  ATOM0_CH1_P00_1,  ATOM0_CH1_P00_2,  ATOM0_CH1_P02_1,  ATOM0_CH1_P10_1,  ATOM0_CH1_P14_4,  ATOM0_CH1_P21_3, ATOM0_CH1_P22_0,  ATOM0_CH1_P33_9,
  ATOM0_CH2_P00_3,  ATOM0_CH2_P02_2,  ATOM0_CH2_P10_2,  ATOM0_CH2_P10_5,  ATOM0_CH2_P14_3,  ATOM0_CH2_P21_4, ATOM0_CH2_P33_11,
  ATOM0_CH3_P00_4,  ATOM0_CH3_P02_3,  ATOM0_CH3_P10_3,  ATOM0_CH3_P10_6,  ATOM0_CH3_P14_2,  ATOM0_CH3_P21_5, ATOM0_CH3_P22_2,
  ATOM0_CH4_P00_5,  ATOM0_CH4_P02_4,  ATOM0_CH4_P14_1,  ATOM0_CH4_P20_3,  ATOM0_CH4_P21_6,  ATOM0_CH4_P22_3,
  ATOM0_CH5_P00_6,  ATOM0_CH5_P02_5,  ATOM0_CH5_P21_7,  ATOM0_CH5_P32_4,
  ATOM0_CH6_P00_7,  ATOM0_CH6_P02_6,  ATOM0_CH6_P20_0,  ATOM0_CH6_P23_1,
  ATOM0_CH7_P00_8,  ATOM0_CH7_P02_7,  ATOM0_CH7_P20_8,
  ATOM1_CH0_P00_0,  ATOM1_CH0_P02_0,  ATOM1_CH0_P02_8,  ATOM1_CH0_P15_5,  ATOM1_CH0_P15_6,  ATOM1_CH0_P20_12, ATOM1_CH0_P21_2, ATOM1_CH0_P22_1,
  ATOM1_CH1_P00_1,  ATOM1_CH1_P00_2,  ATOM1_CH1_P02_1,  ATOM1_CH1_P10_1,  ATOM1_CH1_P14_6,  ATOM1_CH1_P15_7,  ATOM1_CH1_P15_8, ATOM1_CH1_P20_13, ATOM1_CH1_P21_3, ATOM1_CH1_P22_0, ATOM1_CH1_P33_9,
  ATOM1_CH2_P00_3,  ATOM1_CH2_P02_2,  ATOM1_CH2_P10_2,  ATOM1_CH2_P10_5,  ATOM1_CH2_P14_0,  ATOM1_CH2_P20_14, ATOM1_CH2_P21_4, ATOM1_CH2_P33_11,
  ATOM1_CH3_P00_4,  ATOM1_CH3_P02_3,  ATOM1_CH3_P10_3,  ATOM1_CH3_P10_6,  ATOM1_CH3_P15_0,  ATOM1_CH3_P21_5,  ATOM1_CH3_P22_2,
  ATOM1_CH4_P00_5,  ATOM1_CH4_P02_4,  ATOM1_CH4_P15_1,  ATOM1_CH4_P20_3,  ATOM1_CH4_P21_6,  ATOM1_CH4_P22_3,
  ATOM1_CH5_P00_6,  ATOM1_CH5_P02_5,  ATOM1_CH5_P15_2,  ATOM1_CH5_P20_9,  ATOM1_CH5_P21_7,  ATOM1_CH5_P32_4,
  ATOM1_CH6_P00_7,  ATOM1_CH6_P02_6,  ATOM1_CH6_P15_3,  ATOM1_CH6_P20_0,  ATOM1_CH6_P20_10, ATOM1_CH6_P23_1,
  ATOM1_CH7_P00_8,  ATOM1_CH7_P02_7,  ATOM1_CH7_P15_4,  ATOM1_CH7_P20_11,
  ATOM2_CH0_P00_9,  ATOM2_CH0_P13_3,  ATOM2_CH0_P20_12, ATOM2_CH0_P33_4,  ATOM2_CH0_P33_10,
  ATOM2_CH1_P11_2,  ATOM2_CH1_P20_13, ATOM2_CH1_P33_5,
  ATOM2_CH2_P11_3,  ATOM2_CH2_P20_14, ATOM2_CH2_P33_6,
  ATOM2_CH3_P00_12, ATOM2_CH3_P11_6,  ATOM2_CH3_P15_0,  ATOM2_CH3_P33_7,
  ATOM2_CH4_P11_9,  ATOM2_CH4_P15_1,  ATOM2_CH4_P33_8,  ATOM2_CH4_P33_12,
  ATOM2_CH5_P11_10, ATOM2_CH5_P13_0,  ATOM2_CH5_P15_2,  ATOM2_CH5_P20_9,  ATOM2_CH5_P33_13,
  ATOM2_CH6_P11_11, ATOM2_CH6_P13_1,  ATOM2_CH6_P15_3,  ATOM2_CH6_P20_6,  ATOM2_CH6_P20_10, ATOM2_CH6_P32_0,
  ATOM2_CH7_P11_12, ATOM2_CH7_P13_2,  ATOM2_CH7_P15_4,  ATOM2_CH7_P20_7,  ATOM2_CH7_P20_8,  ATOM2_CH7_P20_11,
  ATOM3_CH0_P00_9,  ATOM3_CH0_P13_3,  ATOM3_CH0_P14_5,  ATOM3_CH0_P15_5,  ATOM3_CH0_P15_6,  ATOM3_CH0_P33_4,  ATOM3_CH0_P33_10,
  ATOM3_CH1_P11_2,  ATOM3_CH1_P14_4,  ATOM3_CH1_P14_6,  ATOM3_CH1_P15_7,  ATOM3_CH1_P15_8,  ATOM3_CH1_P33_5,
  ATOM3_CH2_P11_3,  ATOM3_CH2_P14_0,  ATOM3_CH2_P14_3,  ATOM3_CH2_P33_6,
  ATOM3_CH3_P00_12, ATOM3_CH3_P11_6,  ATOM3_CH3_P14_2,  ATOM3_CH3_P33_7,
  ATOM3_CH4_P11_9,  ATOM3_CH4_P14_1,  ATOM3_CH4_P33_8,  ATOM3_CH4_P33_12,
  ATOM3_CH5_P11_10, ATOM3_CH5_P13_0,  ATOM3_CH5_P33_13,
  ATOM3_CH6_P11_11, ATOM3_CH6_P13_1,  ATOM3_CH6_P20_6,  ATOM3_CH6_P32_0,
  ATOM3_CH7_P11_12, ATOM3_CH7_P13_2,  ATOM3_CH7_P20_7,
- 该部分均为普通IO可根据布线需要进行调整
- (near P11) 左
- (near P7) RX2
- (near P7) TX2
- (near P11) TX3
- (near P11) RX3
- (near P11) 右
- 蓝牙串口模块
- 编码器接口
- (near R56) TX1
- 超声波测距模块
- RX1
- 放在板子前部边缘
- 该部分IO为功能模块IO，如需调整请参见右方文件
- Labels drawn without touching a wire or pin: AN5, AN6, AN7, AN8, AN10, AN11, AN12, AN13, AN16, AN17, AN20, AN21, AN24, AN25, AN35, AN36, AN37, AN38, AN39, AN44, AN45, AN46, AN47, AN48, AN49, P00.8, P00.9, P00.12, P02.6, P02.7, P02.8, P10.1, P10.2, P10.3, P11.11, P11.12, P14.0, P14.1, P15.3, P15.4, P15.5, P15.8, P20.6, P20.7, P20.8, P20.9, P20.10, P20.11, P20.12, P20.13, P20.14, P21.6, P22.0, P22.1, P22.2, P22.3, P23.1, P32.4, P33.4, P33.5, P33.10, P33.11
- Title
- Size:
- Date:
- A4
- Number:
- Time:
- Revision:
- Sheet
- of
- File:
- (in symbol BEEP) +
- (in symbol SAK-TC264D-40F200N BC, part A) Power Supply; System I/O
- (in symbol SAK-TC264D-40F200N BC, part B) Analog Inputs
- (in symbol SAK-TC264D-40F200N BC, part C) Port 00, 02, 10, 11, 13, 14
- (in symbol SAK-TC264D-40F200N BC, part D) Port 15, 20, 21, 22, 23, 32, 33

## Library data of the parts
B1 = BEEP: 蜂鸣器
C1-C16 C19 C21-C47 C52-C55 C57 C58 C60 C62-C67 C75-C77 C79-C91 = Cap: Capacitor
  C1 C2: Published: 8-Jun-2000; LatestRevisionDate: 17-Jul-2002; LatestRevisionNote: Re-released for DXP Platform.; PackageReference: RAD-0.3; Publisher: Altium Limited; PackageDescription: Radial Cap, Thru-Hole; 2 Leads; 0.3 in Pin Spacing
  C25 C30 C35: Published: 8-Jun-2000; LatestRevisionDate: 17-Jul-2002; LatestRevisionNote: Re-released for DXP Platform.; PackageReference: RAD-0.3; Publisher: Altium Limited; PackageDescription: Radial Cap, Thru-Hole; 2 Leads; 0.3 in Pin Spacing; Value: 0.1uF
  C53-C55 C57 C58: Published: 8-Jun-2000; LatestRevisionDate: 17-Jul-2002; LatestRevisionNote: Re-released for DXP Platform.; PackageReference: RAD-0.3; Publisher: Altium Limited; PackageDescription: Radial Cap, Thru-Hole; 2 Leads; 0.3 in Pin Spacing; Value: 1uF
C48-C51 C61 C68-C74 = Cap Pol1: Polarized Capacitor (Radial)
C56 C59 C78 = Cap: Capacitor; Value: 103; Published: 8-Jun-2000; LatestRevisionDate: 17-Jul-2002; LatestRevisionNote: Re-released for DXP Platform.; PackageReference: RAD-0.3; Publisher: Altium Limited; PackageDescription: Radial Cap, Thru-Hole; 2 Leads; 0.3 in Pin Spacing
D1 D14 D15 D17 = LED0: Typical INFRARED GaAs LED
D7-D10 = Diode: Default Diode; pin to pad: 1>2 2>1; Published: 8-Jun-2000; LatestRevisionDate: 17-Jul-2002; LatestRevisionNote: Re-released for DXP Platform.; PackageVersion: Sep-1996; PackageReference: SMC; Publisher: Altium Limited; PackageDescription: DO-214-AB/SMC; 2 C-Bend Leads; Body 7.9 x 5.9 mm, inc. leads (LxW); Code_JEDEC: DO-214-AB
D12 = TVS: 双向瞬态抑制二极管
F1 = Fuse 1: Fuse; Published: 8-Jun-2000; LatestRevisionDate: 17-Jul-2002; LatestRevisionNote: Re-released for DXP Platform.; PackageReference: PIN-W2/E2.8; Publisher: Altium Limited; PackageDescription: Thru-Hole; 2 Leads
JP1 = Jumper: Jumper Wire; Published: 24-Mar-1999; LatestRevisionDate: 17-Jul-2002; LatestRevisionNote: Re-released for DXP Platform.; PackageReference: RAD-0.2; Publisher: Altium Limited; PackageDescription: Radial Cap, Thru-Hole; 2 Leads; 0.2 in Pin Spacing
L1 L2 = Inductor
P2 = Header 10: Header, 10-Pin; LatestRevisionDate: 17-Jul-2002; LatestRevisionNote: Re-released for DXP Platform.; Publisher: Altium Limited
P3 = Header 2: Header, 2-Pin; LatestRevisionDate: 17-Jul-2002; LatestRevisionNote: Re-released for DXP Platform.; Publisher: Altium Limited
P4 = FPC0.5-18P: 贴片
P5 P6 = Header 3X2: Header, 3-Pin, Dual row; LatestRevisionDate: 17-Jul-2002; LatestRevisionNote: Re-released for DXP Platform.; Publisher: Altium Limited
P7 P9 P11 = Header 4: Header, 4-Pin; LatestRevisionDate: 17-Jul-2002; LatestRevisionNote: Re-released for DXP Platform.; Publisher: Altium Limited
P8 = Header 7: Header, 7-Pin; LatestRevisionDate: 17-Jul-2002; LatestRevisionNote: Re-released for DXP Platform.; Publisher: Altium Limited
P10 = Header 3: Header, 3-Pin; LatestRevisionDate: 17-Jul-2002; LatestRevisionNote: Re-released for DXP Platform.; Publisher: Altium Limited
Q1 = P-MOS: P沟道场效应管
Q6 = P-MOS: P沟道场效应管; pin to pad: D>2 G>1 S>3
R1-R34 R37 R38 R41 R42 R45 R46 R49-R67 = Res2: Resistor
  R37 R38 R41 R42 R45 R46 R49 R50: Published: 8-Jun-2000; LatestRevisionDate: 17-Jul-2002; LatestRevisionNote: Re-released for DXP Platform.; PackageReference: AXIAL-0.4; Publisher: Altium Limited; PackageDescription: Axial Device, Thru-Hole; 2 Leads; 0.4 in Pin Spacing; Value: 10R
  R51: Published: 8-Jun-2000; LatestRevisionDate: 17-Jul-2002; LatestRevisionNote: Re-released for DXP Platform.; PackageReference: AXIAL-0.4; Publisher: Altium Limited; PackageDescription: Axial Device, Thru-Hole; 2 Leads; 0.4 in Pin Spacing; Value: 10K
R35 R36 R39 R40 R43 R44 R47 R48 = Res2: Resistor; Value: 10R; Published: 8-Jun-2000; LatestRevisionDate: 17-Jul-2002; LatestRevisionNote: Re-released for DXP Platform.; PackageReference: AXIAL-0.4; Publisher: Altium Limited; PackageDescription: Axial Device, Thru-Hole; 2 Leads; 0.4 in Pin Spacing
S1-S5 = SW-PB: Switch; Published: 24-Mar-1999; LatestRevisionDate: 17-Jul-2002; LatestRevisionNote: Re-released for DXP Platform.; PackageReference: SPST-2; Publisher: Altium Limited; PackageDescription: Switch; 2 Leads
S6 = SW-SPST: Single-Pole, Single-Throw Switch; Published: 24-Mar-1999; LatestRevisionDate: 17-Jul-2002; LatestRevisionNote: Re-released for DXP Platform.; PackageReference: SPST-2; Publisher: Altium Limited; PackageDescription: Switch; 2 Leads
U1 = SAK-TC264D-40F200N BC: 32-Bit Single-Chip Microcontroller BC-Step; Manufacturer: Infineon Technologies; PackageReference: PG-LQFP-144-22; ManufacturerPartNumber: SAK-TC264D-40F200N BC
U2 = CON3: Connector
U3-U5 = AD8606ARZ-REEL7: Double Channel Wide Bandwidth Operational Amplifier, 10 MHz BW, 5 V/us SR, Industrial, 8-pin SOIC (R-8), Reel; Manufacturer: Analog Devices; Amplifiers Per Package: 2; Input Bias Current: 200fA; Input Offset Voltage: 20uV; Iq/Amp: 1.2mA; Slew Rate: 5V/us; Small Signal Bandwidth: 10MHz; V Span Max: 6V; V Span Min: 2.7V; DatasheetVersion: Rev. L; PackageVersion: 060506-A; PackageReference: R-8; PackageDescription: 8-Pin Standard Small Outline Package, Body 3.9 x 4.9 mm, Pitch 1.27 mm; Supplier 1: Digi-Key; Supplier Part Number 1: AD8606ARZ-REEL7TR-ND; Supplier 2: Digi-Key; Supplier Part Number 2: AD8606ARZ-REEL7CT-ND; Supplier 3: Digi-Key; Supplier Part Number 3: AD8606ARZ-REEL7DKR-ND; Supplier 4: Newark; Supplier Part Number 4: 59K6924; Generic Part Number: AD8606; Mounting Technology: Surface Mount; Code_JEDEC: MS-012-AA; PartNumber: AD8606ARZ-REEL7; ComponentLink1Description: Manufacturer URL; ComponentLink1URL: http://www.analog.com/en/index.html; ComponentLink2Description: Datasheet; ComponentLink2URL: http://www.analog.com/static/imported-files/data_sheets/AD8605_8606_8608.pdf; ComponentLink3Description: Package Specification; ComponentLink3URL: http://www.analog.com/static/imported-files/packages/PKG_PDF/SOIC_Narrow%20(R)/R_8.pdf; ComponentLink4Description: Reference Circuit; ComponentLink4URL: http://www.analog.com/en/all-operational-amplifiers-op-amps/operational-amplifiers-op-amps/ad8606/products/product.html#product-recommendations
U10 = WRB_SD-3WR2
U11 U12 = TPS73633DBVR: Single Output Low Noise LDO, 400 mA, Fixed 3.3 V Output, 1.7 to 5.5 V Input, with Reverse Current Protection, 5-pin SOT-23 (DBV), -40 to 85 degC, Green (RoHS & no Sb/Br); Manufacturer: Texas Instruments; Accuracy(%): 1; Fixed Output Options(V): 3.3; Iout(Max)(A): 0.4; Iq(Typ)(mA): 0.3; Rating: Catalog; SubFamily: Single Channel LDO; Vdo(Typ)(mV): 75; Vin(Max)(V): 5.5; Vin(Min)(V): 1.7; DatasheetVersion: SBVS038T; PackageVersion: 4073253-4/K; PackageReference: DBV5; PackageDescription: 5-Pin Plastic Small Outline, Body 1.60 脳 2.90 mm, Pitch 0.95 mm; Supplier 1: Digi-Key; Supplier Part Number 1: 296-27064-2-ND; Supplier 2: Digi-Key; Supplier Part Number 2: 296-27064-1-ND; Supplier 3: Digi-Key; Supplier Part Number 3: 296-27064-6-ND; Supplier 4: Newark; Supplier Part Number 4: 87H2980; Supplier 5: Mouser; Supplier Part Number 5: 595-TPS73633DBVR; Eco-Plan: Green (RoHS & no Sb/Br); Vout Adj(Max)(V): 3.3; Vout Adj(Min)(V): 3.3; Mounting Technology: Surface Mount; Code_JEDEC: MO-178; PartNumber: TPS73633DBVR; ComponentLink1Description: Manufacturer URL; ComponentLink1URL: http://www.ti.com/; ComponentLink2Description: Datasheet; ComponentLink2URL: http://www.ti.com/general/docs/lit/getliterature.tsp?genericPartNumber=TPS73633&fileType=pdf; ComponentLink3Description: Package Specification; ComponentLink3URL: http://www.ti.com/litv/pdf/mpds018i; ComponentLink4Description: URL Link1; ComponentLink4URL: Samples URL:http://www.ti.com/product/tps73633#samples
U13 = Optoisolator1: 4-Pin Phototransistor Optocoupler; Published: 24-Mar-1999; LatestRevisionDate: 04-Mar-2005; LatestRevisionNote: Sch pins 3 & 4 Swapped.; DatasheetVersion: Nov-2003; PackageReference: DIP-4; Publisher: Altium Limited
Y1 = XTAL: Value: 16M